# Altium schematic sheet SAMA7D65_DDR3L.SchDoc
size 420 x 297 mm; SheetNumber: 9; SheetTotal: 23
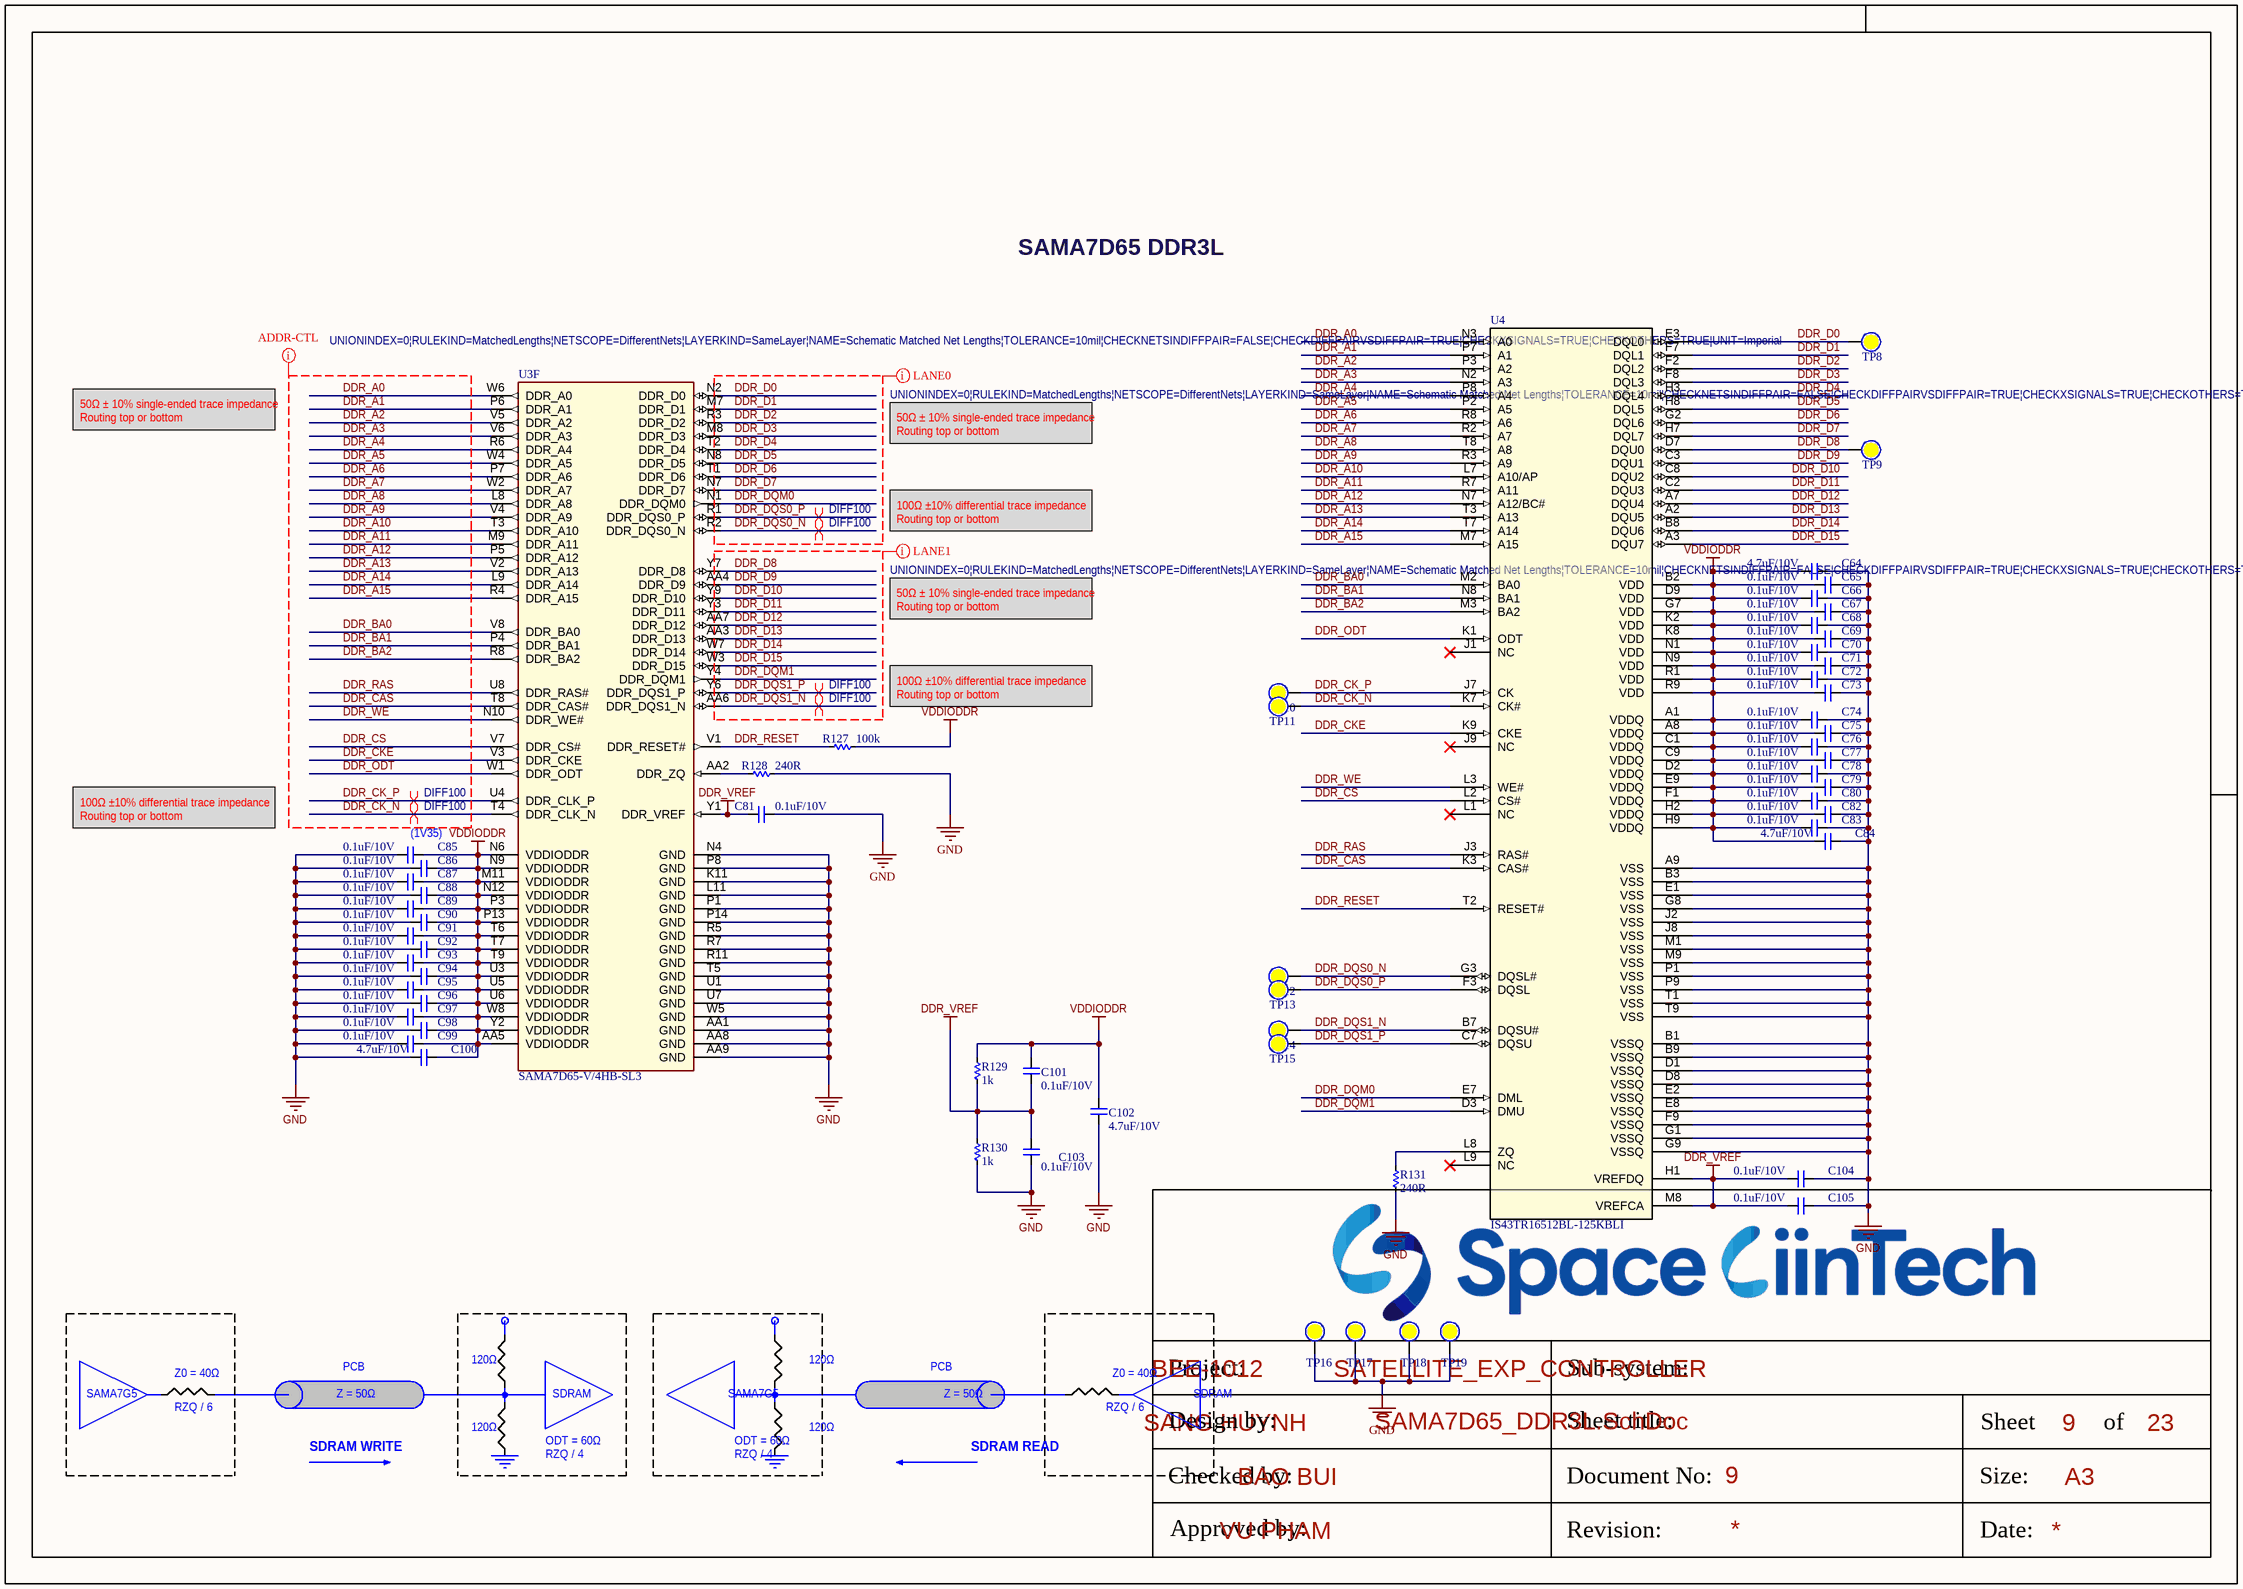
[diagram p0: SAMA7D65_DDR3L.SchDoc]

## Parts
C64  4.7uF/10V  [CAP_C_1005X50_L]
C65  0.1uF/10V  [CAP_C_0603x30]
C66  0.1uF/10V  [CAP_C_0603x30]
C67  0.1uF/10V  [CAP_C_0603x30]
C68  0.1uF/10V  [CAP_C_0603x30]
C69  0.1uF/10V  [CAP_C_0603x30]
C70  0.1uF/10V  [CAP_C_0603x30]
C71  0.1uF/10V  [CAP_C_0603x30]
C72  0.1uF/10V  [CAP_C_0603x30]
C73  0.1uF/10V  [CAP_C_0603x30]
C74  0.1uF/10V  [CAP_C_0603x30]
C75  0.1uF/10V  [CAP_C_0603x30]
C76  0.1uF/10V  [CAP_C_0603x30]
C77  0.1uF/10V  [CAP_C_0603x30]
C78  0.1uF/10V  [CAP_C_0603x30]
C79  0.1uF/10V  [CAP_C_0603x30]
C80  0.1uF/10V  [CAP_C_0603x30]
C81  0.1uF/10V  [CAP_C_0603x30]
C82  0.1uF/10V  [CAP_C_0603x30]
C83  0.1uF/10V  [CAP_C_0603x30]
C84  4.7uF/10V  [CAP_C_1005X50_L]
C85  0.1uF/10V  [CAP_C_0603x30]
C86  0.1uF/10V  [CAP_C_0603x30]
C87  0.1uF/10V  [CAP_C_0603x30]
C88  0.1uF/10V  [CAP_C_0603x30]
C89  0.1uF/10V  [CAP_C_0603x30]
C90  0.1uF/10V  [CAP_C_0603x30]
C91  0.1uF/10V  [CAP_C_0603x30]
C92  0.1uF/10V  [CAP_C_0603x30]
C93  0.1uF/10V  [CAP_C_0603x30]
C94  0.1uF/10V  [CAP_C_0603x30]
C95  0.1uF/10V  [CAP_C_0603x30]
C96  0.1uF/10V  [CAP_C_0603x30]
C97  0.1uF/10V  [CAP_C_0603x30]
C98  0.1uF/10V  [CAP_C_0603x30]
C99  0.1uF/10V  [CAP_C_0603x30]
C100  4.7uF/10V  [CAP_C_1005X50_L]
C101  0.1uF/10V  [CAP_C_0603x30]
C102  4.7uF/10V  [CAP_C_1005X50_L]
C103  0.1uF/10V  [CAP_C_0603x30]
C104  0.1uF/10V  [CAP_C_0603x30]
C105  0.1uF/10V  [CAP_C_0603x30]
R127  100k  [RES_C_0603X30]
R128  240R  [RES_C_0603X30]
R129  1k  [RES_C_0603X30]
R130  1k  [RES_C_0603X30]
R131  240R  [RES_C_0603X30]
TP8  (no value)  [Test point]  (no BOM)
TP9  (no value)  [Test point]  (no BOM)
TP10  (no value)  [Test point]  (no BOM)
TP11  (no value)  [Test point]  (no BOM)
TP12  (no value)  [Test point]  (no BOM)
TP13  (no value)  [Test point]  (no BOM)
TP14  (no value)  [Test point]  (no BOM)
TP15  (no value)  [Test point]  (no BOM)
TP16  (no value)  [Test point]  (no BOM)
TP17  (no value)  [Test point]  (no BOM)
TP18  (no value)  [Test point]  (no BOM)
TP19  (no value)  [Test point]  (no BOM)
U3  value SAMA7D65-V/4HB-SL3  [TFBGA-343_14x14]  (hidden comment: SAMA7D65)  (part F of 8)
U4  IS43TR16512BL-125KBLI  [TWBGA96_ISI]

## Nets
DDR_VREF: C81.1 C101.1 C103.2 C104.1 C105.1 R129.1 R130.2 U3.Y1(DDR_VREF) U4.H1(VREFDQ) U4.M8(VREFCA)
GND: C64.2 C65.2 C66.2 C67.2 C68.2 C69.2 C70.2 C71.2 C72.2 C73.2 C74.2 C75.2 C76.2 C77.2 C78.2 C79.2 C80.2 C81.2 C82.2 C83.2 C84.2 C85.1 C86.1 C87.1 C88.1 C89.1 C90.1 C91.1 C92.1 C93.1 C94.1 C95.1 C96.1 C97.1 C98.1 C99.1 C100.1 C102.1 C103.1 C104.2 C105.2 R128.2 R130.1 R131.1 TP16.0 TP17.0 TP18.0 TP19.0 U3.AA1(GND) U3.AA8(GND) U3.AA9(GND) U3.K11(GND) U3.L11(GND) U3.N4(GND) U3.P1(GND) U3.P8(GND) U3.P14(GND) U3.R5(GND) U3.R7(GND) U3.R11(GND) U3.T5(GND) U3.U1(GND) U3.U7(GND) U3.W5(GND) U4.A9(VSS) U4.B1(VSSQ) U4.B3(VSS) U4.B9(VSSQ) U4.D1(VSSQ) U4.D8(VSSQ) U4.E1(VSS) U4.E2(VSSQ) U4.E8(VSSQ) U4.F9(VSSQ) U4.G1(VSSQ) U4.G8(VSS) U4.G9(VSSQ) U4.J2(VSS) U4.J8(VSS) U4.M1(VSS) U4.M9(VSS) U4.P1(VSS) U4.P9(VSS) U4.T1(VSS) U4.T9(VSS)
VDDIODDR: C64.1 C65.1 C66.1 C67.1 C68.1 C69.1 C70.1 C71.1 C72.1 C73.1 C74.1 C75.1 C76.1 C77.1 C78.1 C79.1 C80.1 C82.1 C83.1 C84.1 C85.2 C86.2 C87.2 C88.2 C89.2 C90.2 C91.2 C92.2 C93.2 C94.2 C95.2 C96.2 C97.2 C98.2 C99.2 C100.2 C101.2 C102.2 R127.2 R129.2 U3.AA5(VDDIODDR) U3.M11(VDDIODDR) U3.N6(VDDIODDR) U3.N9(VDDIODDR) U3.N12(VDDIODDR) U3.P3(VDDIODDR) U3.P13(VDDIODDR) U3.T6(VDDIODDR) U3.T7(VDDIODDR) U3.T9(VDDIODDR) U3.U3(VDDIODDR) U3.U5(VDDIODDR) U3.U6(VDDIODDR) U3.W8(VDDIODDR) U3.Y2(VDDIODDR) U4.A1(VDDQ) U4.A8(VDDQ) U4.B2(VDD) U4.C1(VDDQ) U4.C9(VDDQ) U4.D2(VDDQ) U4.D9(VDD) U4.E9(VDDQ) U4.F1(VDDQ) U4.G7(VDD) U4.H2(VDDQ) U4.H9(VDDQ) U4.K2(VDD) U4.K8(VDD) U4.N1(VDD) U4.N9(VDD) U4.R1(VDD) U4.R9(VDD)
DDR_A0: U3.W6(DDR_A0) U4.N3(A0)
DDR_A1: U3.P6(DDR_A1) U4.P7(A1)
DDR_A2: U3.V5(DDR_A2) U4.P3(A2)
DDR_A3: U3.V6(DDR_A3) U4.N2(A3)
DDR_A4: U3.R6(DDR_A4) U4.P8(A4)
DDR_A5: U3.W4(DDR_A5) U4.P2(A5)
DDR_A6: U3.P7(DDR_A6) U4.R8(A6)
DDR_A7: U3.W2(DDR_A7) U4.R2(A7)
DDR_A8: U3.L8(DDR_A8) U4.T8(A8)
DDR_A9: U3.V4(DDR_A9) U4.R3(A9)
DDR_A10: U3.T3(DDR_A10) U4.L7(A10/AP)
DDR_A11: U3.M9(DDR_A11) U4.R7(A11)
DDR_A12: U3.P5(DDR_A12) U4.N7(A12/BC#)
DDR_A13: U3.V2(DDR_A13) U4.T3(A13)
DDR_A14: U3.L9(DDR_A14) U4.T7(A14)
DDR_A15: U3.R4(DDR_A15) U4.M7(A15)
DDR_BA0: U3.V8(DDR_BA0) U4.M2(BA0)
DDR_BA1: U3.P4(DDR_BA1) U4.N8(BA1)
DDR_BA2: U3.R8(DDR_BA2) U4.M3(BA2)
DDR_CAS: U3.T8(DDR_CAS#) U4.K3(CAS#)
DDR_CK_N: TP11.0 U3.T4(DDR_CLK_N) U4.K7(CK#)
DDR_CK_P: TP10.0 U3.U4(DDR_CLK_P) U4.J7(CK)
DDR_CKE: U3.V3(DDR_CKE) U4.K9(CKE)
DDR_CS: U3.V7(DDR_CS#) U4.L2(CS#)
DDR_D0: TP8.0 U3.N2(DDR_D0) U4.E3(DQL0)
DDR_D1: U3.M7(DDR_D1) U4.F7(DQL1)
DDR_D2: U3.R3(DDR_D2) U4.F2(DQL2)
DDR_D3: U3.M8(DDR_D3) U4.F8(DQL3)
DDR_D4: U3.T2(DDR_D4) U4.H3(DQL4)
DDR_D5: U3.N8(DDR_D5) U4.H8(DQL5)
DDR_D6: U3.T1(DDR_D6) U4.G2(DQL6)
DDR_D7: U3.N7(DDR_D7) U4.H7(DQL7)
DDR_D8: TP9.0 U3.Y7(DDR_D8) U4.D7(DQU0)
DDR_D9: U3.AA4(DDR_D9) U4.C3(DQU1)
DDR_D10: U3.Y9(DDR_D10) U4.C8(DQU2)
DDR_D11: U3.Y3(DDR_D11) U4.C2(DQU3)
DDR_D12: U3.AA7(DDR_D12) U4.A7(DQU4)
DDR_D13: U3.AA3(DDR_D13) U4.A2(DQU5)
DDR_D14: U3.W7(DDR_D14) U4.B8(DQU6)
DDR_D15: U3.W3(DDR_D15) U4.A3(DQU7)
DDR_DQM0: U3.N1(DDR_DQM0) U4.E7(DML)
DDR_DQM1: U3.Y4(DDR_DQM1) U4.D3(DMU)
DDR_DQS0_N: TP12.0 U3.R2(DDR_DQS0_N) U4.G3(DQSL#)
DDR_DQS0_P: TP13.0 U3.R1(DDR_DQS0_P) U4.F3(DQSL)
DDR_DQS1_N: TP14.0 U3.AA6(DDR_DQS1_N) U4.B7(DQSU#)
DDR_DQS1_P: TP15.0 U3.Y6(DDR_DQS1_P) U4.C7(DQSU)
DDR_ODT: U3.W1(DDR_ODT) U4.K1(ODT)
DDR_RAS: U3.U8(DDR_RAS#) U4.J3(RAS#)
DDR_RESET: R127.1 U3.V1(DDR_RESET#) U4.T2(RESET#)
DDR_WE: U3.N10(DDR_WE#) U4.L3(WE#)
NetR128_1: R128.1 U3.AA2(DDR_ZQ)
NetR131_2: R131.2 U4.L8(ZQ)

Not connected (* = marked no-connect by the designer): U4 J1(NC)* J9(NC)* L1(NC)* L9(NC)*

## Layout directives
net class DDR-ADDR-CTL; rule Matched Net Lengths [Tolerance = 10mil]: DDR_A0, DDR_A1, DDR_A2, DDR_A3, DDR_A4, DDR_A5, DDR_A6, DDR_A7, DDR_A8, DDR_A9, DDR_A10, DDR_A11, DDR_A12, DDR_A13, DDR_A14, DDR_A15, DDR_BA0, DDR_BA1, DDR_BA2, DDR_CAS, DDR_CK_N, DDR_CK_P, DDR_CKE, DDR_CS, DDR_ODT, DDR_RAS, DDR_WE
differential pair; differential pair class DIFF100; net class DIFF100; rule Matched Net Lengths [Tolerance = 4mil]: DDR_CK_N, DDR_CK_P, DDR_DQS0_N, DDR_DQS0_P, DDR_DQS1_N, DDR_DQS1_P
net class DDR-LANE0; rule Matched Net Lengths [Tolerance = 10mil]: DDR_D0, DDR_D1, DDR_D2, DDR_D3, DDR_D4, DDR_D5, DDR_D6, DDR_D7, DDR_DQM0, DDR_DQS0_N, DDR_DQS0_P
net class DDR-LANE1; rule Matched Net Lengths [Tolerance = 10mil]: DDR_D8, DDR_D9, DDR_D10, DDR_D11, DDR_D12, DDR_D13, DDR_D14, DDR_D15, DDR_DQM1, DDR_DQS1_N, DDR_DQS1_P

## Notes on the sheet
- SAMA7D65 DDR3L
- 50Ω ± 10% single-ended trace impedance
  Routing top or bottom
- 100Ω ±10% differential trace impedance
  Routing top or bottom
- (near C85) (1V35)
- SAMA7G5
- Z0 = 40Ω
- Z = 50Ω
- PCB
- 120Ω
- SDRAM
- RZQ / 6
- SDRAM WRITE
- ODT = 60Ω
- RZQ / 4
- SDRAM READ
- Project:
- BEE-1012
- Sub-system:
- SATELLITE_EXP_CONTROLLER
- Design by:
- SANG HUYNH
- BAO BUI
- Sheet title:
- Sheet
- A3
- of
- Checked by:
- Approved by:
- VU PHAM
- Revision:
- Document No:
- Size:
- Date:

## Library data of the parts
C64-C105 = _CAP_C_2: CAP CHIP
R127-R131 = _RES_B_2: RES
TP8-TP19 = Test Point: Solder: NF
U3 = SAMA7D65: SAMA7D65 MPU 1000MHz Cortex-A7 TFBGA-343; Manufacturer 1: Microchip Technology; Description_: MCHP MPU 32-BIT Cortex-A7 1000MHz 128kB SAMA7D65-V/4HB-SL3 TFBGA-343; Populated: YES; MCHP-ID: IC2674; Symbol: SAMA7D65-TFBGA-343; Dev Tools Status: Design; Owner: Ciprian Abramov; Restricted Sourcing: No; Manufacturer Part Number 1: SAMA7D65-V/4HB-SL3; Type: 32-Bit MPU; Status: MCL Design; Revision: 1; Category: MCHP-Microcontroller; ComponentLink1URL: https://www.microchip.com/sitesearch/search/Product%20and%20Development%20Tools/SAMA7D65-V/4HB-SL3; ComponentLink1Description: SVN Datasheet; ComponentLink2Description: Local Datasheet; ComponentLink3URL: C:\ALTIUM_WORK\00001_MCHP-CDB\Library\LibraryRefs\SAMA7D65-TFBGA-343.SchLib; ComponentLink3Description: Open Symbol; ComponentLink4URL: C:\ALTIUM_WORK\00001_MCHP-CDB\Library\Footprints\TFBGA-343_14x14.PcbLib; ComponentLink4Description: Open Footprint; ComponentLink5Description: Open Footprint 2; ComponentLink6Description: Open Footprint 3; ComponentLink7Description: Open Footprint 4; Supplier 1: Microchip Technology; Supplier Part Number 1: SAMA7D65-V/4HB-SL3; Operating Temperature: -40C to +105C; Quantity Override: 1
U4 = IC_RAM_IS43TR16512BL-125KBLI: DDR3L; Manufacturer_Name: ISSI; Copyright: Copyright (C) 2025 Ultra Librarian. All rights reserved.; Manufacturer_Part_Number: IS43TR16512BL-125KBLI; RefDes: RefDes; Type: Type